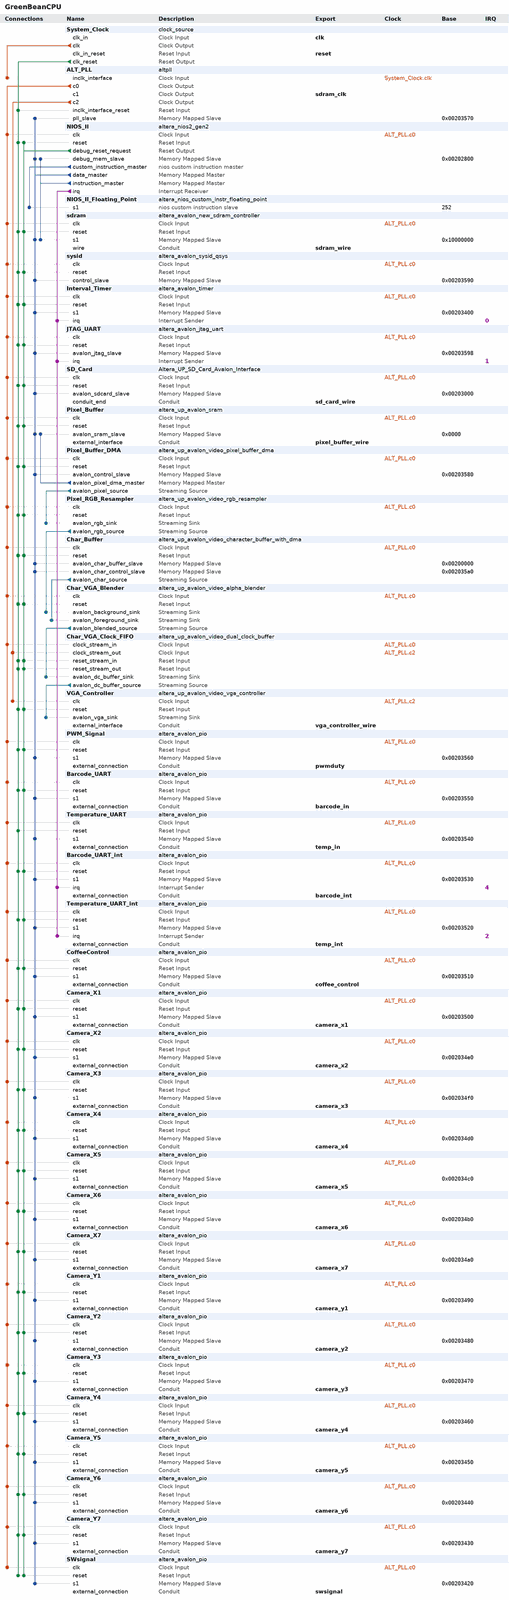
[diagram p0: system contents, whole]
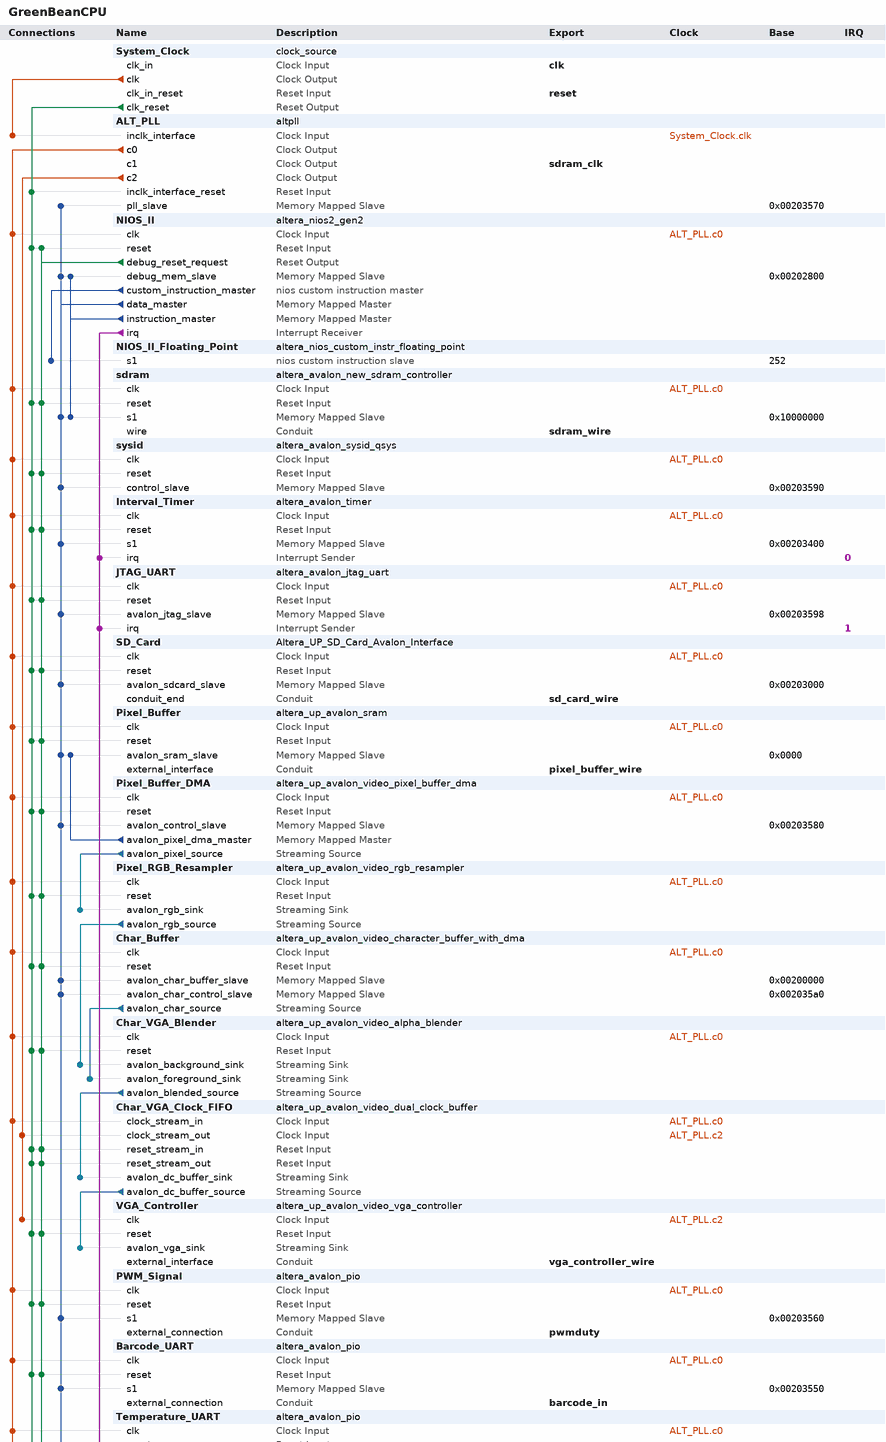
[diagram p1: system contents, upper part]
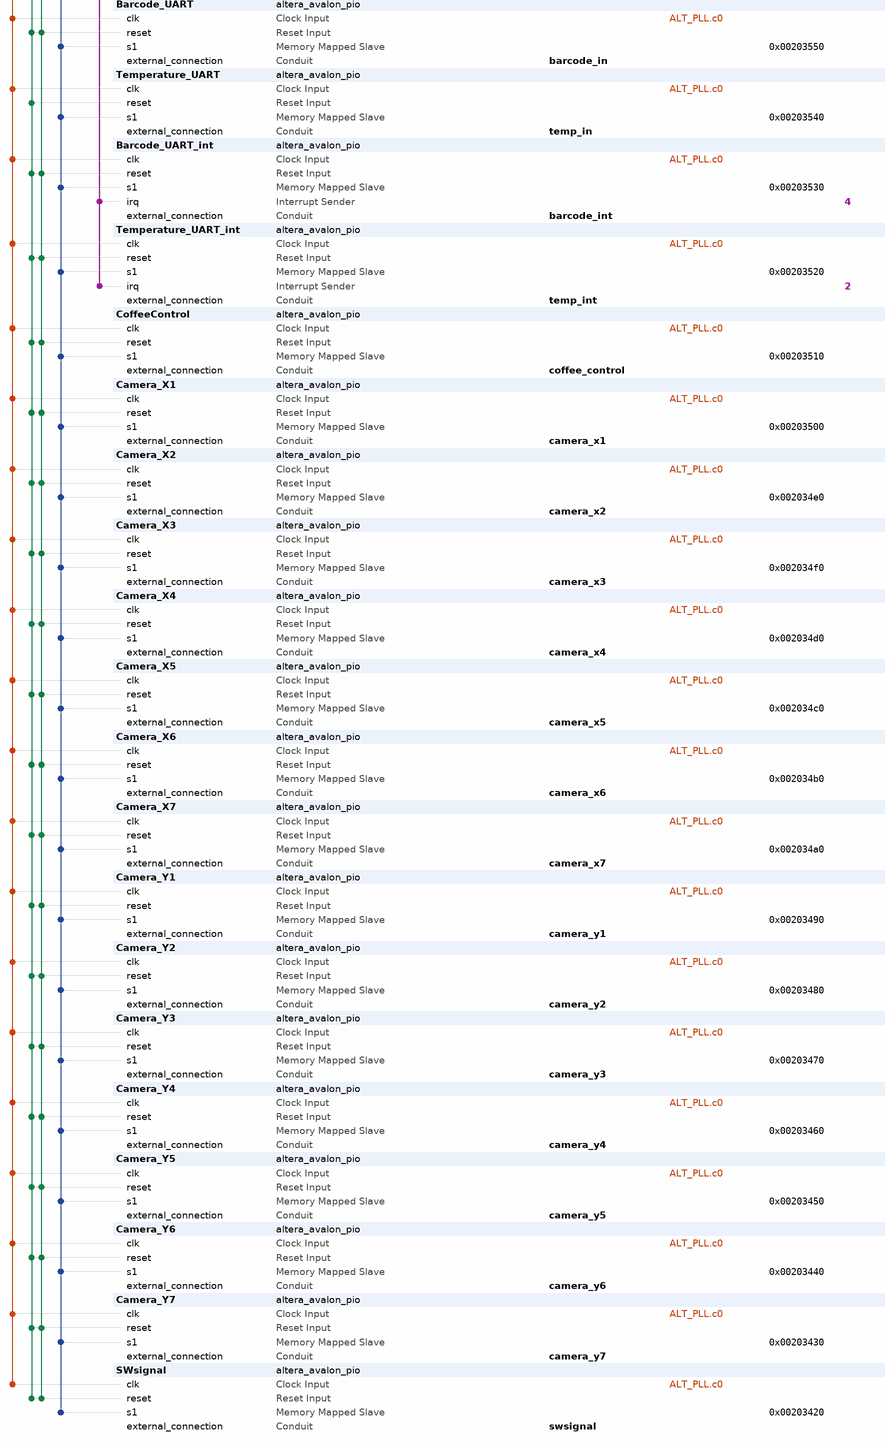
[diagram p2: system contents, lower part]
# Platform Designer (Qsys) system GreenBeanCPU, Cyclone IV E EP4CE115F29C7
# Parameters at their usual value, and those the tool derives, are not listed.
package require -exact qsys 16.1
create_system GreenBeanCPU
set_project_property DEVICE_FAMILY {Cyclone IV E}
set_project_property DEVICE EP4CE115F29C7

add_instance System_Clock clock_source 16.1
set_instance_parameter_value System_Clock clockFrequency 50000000

add_instance ALT_PLL altpll 16.1
set_instance_parameter_value ALT_PLL CLK0_DIVIDE_BY 1
set_instance_parameter_value ALT_PLL CLK0_MULTIPLY_BY 1
set_instance_parameter_value ALT_PLL CLK1_DIVIDE_BY 1
set_instance_parameter_value ALT_PLL CLK1_DUTY_CYCLE 50
set_instance_parameter_value ALT_PLL CLK1_MULTIPLY_BY 1
set_instance_parameter_value ALT_PLL CLK1_PHASE_SHIFT -3000
set_instance_parameter_value ALT_PLL CLK2_DIVIDE_BY 2
set_instance_parameter_value ALT_PLL CLK2_DUTY_CYCLE 50
set_instance_parameter_value ALT_PLL CLK2_MULTIPLY_BY 1
set_instance_parameter_value ALT_PLL CLK2_PHASE_SHIFT 0
set_instance_parameter_value ALT_PLL INCLK0_INPUT_FREQUENCY 20000
set_instance_parameter_value ALT_PLL PORT_ARESET PORT_UNUSED
set_instance_parameter_value ALT_PLL PORT_LOCKED PORT_UNUSED
set_instance_parameter_value ALT_PLL PORT_clk1 PORT_USED
set_instance_parameter_value ALT_PLL PORT_clk2 PORT_USED
set_instance_parameter_value ALT_PLL PORT_clk3 PORT_UNUSED

add_instance NIOS_II altera_nios2_gen2 16.1
set_instance_parameter_value NIOS_II dcache_size 2048
set_instance_parameter_value NIOS_II exceptionSlave sdram.s1
set_instance_parameter_value NIOS_II icache_size 4096
set_instance_parameter_value NIOS_II impl Fast
set_instance_parameter_value NIOS_II resetSlave sdram.s1

add_instance NIOS_II_Floating_Point altera_nios_custom_instr_floating_point 16.1

add_instance sdram altera_avalon_new_sdram_controller 16.1
set_instance_parameter_value sdram TAC 5.5
set_instance_parameter_value sdram TRCD 20.0
set_instance_parameter_value sdram TRP 20.0
set_instance_parameter_value sdram casLatency 3
set_instance_parameter_value sdram columnWidth 10
set_instance_parameter_value sdram dataWidth 32
set_instance_parameter_value sdram generateSimulationModel false
set_instance_parameter_value sdram model single_Micron_MT48LC4M32B2_7_chip
set_instance_parameter_value sdram numberOfBanks 4
set_instance_parameter_value sdram numberOfChipSelects 1
set_instance_parameter_value sdram powerUpDelay 200.0
set_instance_parameter_value sdram refreshPeriod 7.8125
set_instance_parameter_value sdram rowWidth 13

add_instance sysid altera_avalon_sysid_qsys 16.1
set_instance_parameter_value sysid id 0

add_instance Interval_Timer altera_avalon_timer 16.1
set_instance_parameter_value Interval_Timer period 1
set_instance_parameter_value Interval_Timer periodUnits MSEC

add_instance JTAG_UART altera_avalon_jtag_uart 16.1
set_instance_parameter_value JTAG_UART simInteractiveOptions NO_INTERACTIVE_WINDOWS

add_instance SD_Card Altera_UP_SD_Card_Avalon_Interface 16.1

add_instance Pixel_Buffer altera_up_avalon_sram 16.1
set_instance_parameter_value Pixel_Buffer board DE2-115
set_instance_parameter_value Pixel_Buffer pixel_buffer true

add_instance Pixel_Buffer_DMA altera_up_avalon_video_pixel_buffer_dma 16.1
set_instance_parameter_value Pixel_Buffer_DMA addr_mode X-Y
set_instance_parameter_value Pixel_Buffer_DMA back_start_address 0
set_instance_parameter_value Pixel_Buffer_DMA color_space {24-bit RGB}
set_instance_parameter_value Pixel_Buffer_DMA image_height 480
set_instance_parameter_value Pixel_Buffer_DMA image_width 640
set_instance_parameter_value Pixel_Buffer_DMA start_address 0

add_instance Pixel_RGB_Resampler altera_up_avalon_video_rgb_resampler 16.1
set_instance_parameter_value Pixel_RGB_Resampler alpha 1023
set_instance_parameter_value Pixel_RGB_Resampler input_type {24-bit RGB}
set_instance_parameter_value Pixel_RGB_Resampler output_type {30-bit RGB}

add_instance Char_Buffer altera_up_avalon_video_character_buffer_with_dma 16.1
set_instance_parameter_value Char_Buffer enable_transparency true

add_instance Char_VGA_Blender altera_up_avalon_video_alpha_blender 16.1

add_instance Char_VGA_Clock_FIFO altera_up_avalon_video_dual_clock_buffer 16.1
set_instance_parameter_value Char_VGA_Clock_FIFO color_bits 10

add_instance VGA_Controller altera_up_avalon_video_vga_controller 16.1
set_instance_parameter_value VGA_Controller board DE2-115
set_instance_parameter_value VGA_Controller resolution {VGA 640x480}

add_instance PWM_Signal altera_avalon_pio 16.1
set_instance_parameter_value PWM_Signal direction Output
set_instance_parameter_value PWM_Signal width 20

add_instance Barcode_UART altera_avalon_pio 16.1
set_instance_parameter_value Barcode_UART direction Input
set_instance_parameter_value Barcode_UART width 8

add_instance Temperature_UART altera_avalon_pio 16.1
set_instance_parameter_value Temperature_UART direction Input
set_instance_parameter_value Temperature_UART width 8

add_instance Barcode_UART_int altera_avalon_pio 16.1
set_instance_parameter_value Barcode_UART_int captureEdge true
set_instance_parameter_value Barcode_UART_int direction Input
set_instance_parameter_value Barcode_UART_int generateIRQ true
set_instance_parameter_value Barcode_UART_int irqType EDGE
set_instance_parameter_value Barcode_UART_int width 1

add_instance Temperature_UART_int altera_avalon_pio 16.1
set_instance_parameter_value Temperature_UART_int captureEdge true
set_instance_parameter_value Temperature_UART_int direction Input
set_instance_parameter_value Temperature_UART_int generateIRQ true
set_instance_parameter_value Temperature_UART_int irqType EDGE
set_instance_parameter_value Temperature_UART_int width 1

add_instance CoffeeControl altera_avalon_pio 16.1
set_instance_parameter_value CoffeeControl direction Output
set_instance_parameter_value CoffeeControl width 3

add_instance Camera_X1 altera_avalon_pio 16.1
set_instance_parameter_value Camera_X1 direction Input
set_instance_parameter_value Camera_X1 width 17

add_instance Camera_X2 altera_avalon_pio 16.1
set_instance_parameter_value Camera_X2 direction Input
set_instance_parameter_value Camera_X2 width 17

add_instance Camera_X3 altera_avalon_pio 16.1
set_instance_parameter_value Camera_X3 direction Input
set_instance_parameter_value Camera_X3 width 17

add_instance Camera_X4 altera_avalon_pio 16.1
set_instance_parameter_value Camera_X4 direction Input
set_instance_parameter_value Camera_X4 width 17

add_instance Camera_X5 altera_avalon_pio 16.1
set_instance_parameter_value Camera_X5 direction Input
set_instance_parameter_value Camera_X5 width 17

add_instance Camera_X6 altera_avalon_pio 16.1
set_instance_parameter_value Camera_X6 direction Input
set_instance_parameter_value Camera_X6 width 17

add_instance Camera_X7 altera_avalon_pio 16.1
set_instance_parameter_value Camera_X7 direction Input
set_instance_parameter_value Camera_X7 width 17

add_instance Camera_Y1 altera_avalon_pio 16.1
set_instance_parameter_value Camera_Y1 direction Input
set_instance_parameter_value Camera_Y1 width 17

add_instance Camera_Y2 altera_avalon_pio 16.1
set_instance_parameter_value Camera_Y2 direction Input
set_instance_parameter_value Camera_Y2 width 17

add_instance Camera_Y3 altera_avalon_pio 16.1
set_instance_parameter_value Camera_Y3 direction Input
set_instance_parameter_value Camera_Y3 width 17

add_instance Camera_Y4 altera_avalon_pio 16.1
set_instance_parameter_value Camera_Y4 direction Input
set_instance_parameter_value Camera_Y4 width 17

add_instance Camera_Y5 altera_avalon_pio 16.1
set_instance_parameter_value Camera_Y5 direction Input
set_instance_parameter_value Camera_Y5 width 17

add_instance Camera_Y6 altera_avalon_pio 16.1
set_instance_parameter_value Camera_Y6 direction Input
set_instance_parameter_value Camera_Y6 width 17

add_instance Camera_Y7 altera_avalon_pio 16.1
set_instance_parameter_value Camera_Y7 direction Input
set_instance_parameter_value Camera_Y7 width 17

add_instance SWsignal altera_avalon_pio 16.1
set_instance_parameter_value SWsignal direction Output
set_instance_parameter_value SWsignal width 18

# connections
add_connection ALT_PLL.c0 Barcode_UART.clk clock
add_connection ALT_PLL.c0 Barcode_UART_int.clk clock
add_connection ALT_PLL.c0 Camera_X1.clk clock
add_connection ALT_PLL.c0 Camera_X2.clk clock
add_connection ALT_PLL.c0 Camera_X3.clk clock
add_connection ALT_PLL.c0 Camera_X4.clk clock
add_connection ALT_PLL.c0 Camera_X5.clk clock
add_connection ALT_PLL.c0 Camera_X6.clk clock
add_connection ALT_PLL.c0 Camera_X7.clk clock
add_connection ALT_PLL.c0 Camera_Y1.clk clock
add_connection ALT_PLL.c0 Camera_Y2.clk clock
add_connection ALT_PLL.c0 Camera_Y3.clk clock
add_connection ALT_PLL.c0 Camera_Y4.clk clock
add_connection ALT_PLL.c0 Camera_Y5.clk clock
add_connection ALT_PLL.c0 Camera_Y6.clk clock
add_connection ALT_PLL.c0 Camera_Y7.clk clock
add_connection ALT_PLL.c0 Char_Buffer.clk clock
add_connection ALT_PLL.c0 Char_VGA_Blender.clk clock
add_connection ALT_PLL.c0 Char_VGA_Clock_FIFO.clock_stream_in clock
add_connection ALT_PLL.c0 CoffeeControl.clk clock
add_connection ALT_PLL.c0 Interval_Timer.clk clock
add_connection ALT_PLL.c0 JTAG_UART.clk clock
add_connection ALT_PLL.c0 NIOS_II.clk clock
add_connection ALT_PLL.c0 Pixel_Buffer.clk clock
add_connection ALT_PLL.c0 Pixel_Buffer_DMA.clk clock
add_connection ALT_PLL.c0 Pixel_RGB_Resampler.clk clock
add_connection ALT_PLL.c0 PWM_Signal.clk clock
add_connection ALT_PLL.c0 SD_Card.clk clock
add_connection ALT_PLL.c0 sdram.clk clock
add_connection ALT_PLL.c0 SWsignal.clk clock
add_connection ALT_PLL.c0 sysid.clk clock
add_connection ALT_PLL.c0 Temperature_UART.clk clock
add_connection ALT_PLL.c0 Temperature_UART_int.clk clock
add_connection ALT_PLL.c2 Char_VGA_Clock_FIFO.clock_stream_out clock
add_connection ALT_PLL.c2 VGA_Controller.clk clock
add_connection System_Clock.clk ALT_PLL.inclk_interface clock
add_connection NIOS_II.debug_reset_request Barcode_UART.reset reset
add_connection NIOS_II.debug_reset_request Barcode_UART_int.reset reset
add_connection NIOS_II.debug_reset_request Camera_X1.reset reset
add_connection NIOS_II.debug_reset_request Camera_X2.reset reset
add_connection NIOS_II.debug_reset_request Camera_X3.reset reset
add_connection NIOS_II.debug_reset_request Camera_X4.reset reset
add_connection NIOS_II.debug_reset_request Camera_X5.reset reset
add_connection NIOS_II.debug_reset_request Camera_X6.reset reset
add_connection NIOS_II.debug_reset_request Camera_X7.reset reset
add_connection NIOS_II.debug_reset_request Camera_Y1.reset reset
add_connection NIOS_II.debug_reset_request Camera_Y2.reset reset
add_connection NIOS_II.debug_reset_request Camera_Y3.reset reset
add_connection NIOS_II.debug_reset_request Camera_Y4.reset reset
add_connection NIOS_II.debug_reset_request Camera_Y5.reset reset
add_connection NIOS_II.debug_reset_request Camera_Y6.reset reset
add_connection NIOS_II.debug_reset_request Camera_Y7.reset reset
add_connection NIOS_II.debug_reset_request Char_Buffer.reset reset
add_connection NIOS_II.debug_reset_request Char_VGA_Blender.reset reset
add_connection NIOS_II.debug_reset_request Char_VGA_Clock_FIFO.reset_stream_in reset
add_connection NIOS_II.debug_reset_request Char_VGA_Clock_FIFO.reset_stream_out reset
add_connection NIOS_II.debug_reset_request CoffeeControl.reset reset
add_connection NIOS_II.debug_reset_request Interval_Timer.reset reset
add_connection NIOS_II.debug_reset_request JTAG_UART.reset reset
add_connection NIOS_II.debug_reset_request NIOS_II.reset reset
add_connection NIOS_II.debug_reset_request Pixel_Buffer.reset reset
add_connection NIOS_II.debug_reset_request Pixel_Buffer_DMA.reset reset
add_connection NIOS_II.debug_reset_request Pixel_RGB_Resampler.reset reset
add_connection NIOS_II.debug_reset_request PWM_Signal.reset reset
add_connection NIOS_II.debug_reset_request SD_Card.reset reset
add_connection NIOS_II.debug_reset_request sdram.reset reset
add_connection NIOS_II.debug_reset_request SWsignal.reset reset
add_connection NIOS_II.debug_reset_request sysid.reset reset
add_connection NIOS_II.debug_reset_request Temperature_UART_int.reset reset
add_connection NIOS_II.debug_reset_request VGA_Controller.reset reset
add_connection System_Clock.clk_reset ALT_PLL.inclk_interface_reset reset
add_connection System_Clock.clk_reset Barcode_UART.reset reset
add_connection System_Clock.clk_reset Barcode_UART_int.reset reset
add_connection System_Clock.clk_reset Camera_X1.reset reset
add_connection System_Clock.clk_reset Camera_X2.reset reset
add_connection System_Clock.clk_reset Camera_X3.reset reset
add_connection System_Clock.clk_reset Camera_X4.reset reset
add_connection System_Clock.clk_reset Camera_X5.reset reset
add_connection System_Clock.clk_reset Camera_X6.reset reset
add_connection System_Clock.clk_reset Camera_X7.reset reset
add_connection System_Clock.clk_reset Camera_Y1.reset reset
add_connection System_Clock.clk_reset Camera_Y2.reset reset
add_connection System_Clock.clk_reset Camera_Y3.reset reset
add_connection System_Clock.clk_reset Camera_Y4.reset reset
add_connection System_Clock.clk_reset Camera_Y5.reset reset
add_connection System_Clock.clk_reset Camera_Y6.reset reset
add_connection System_Clock.clk_reset Camera_Y7.reset reset
add_connection System_Clock.clk_reset Char_Buffer.reset reset
add_connection System_Clock.clk_reset Char_VGA_Blender.reset reset
add_connection System_Clock.clk_reset Char_VGA_Clock_FIFO.reset_stream_in reset
add_connection System_Clock.clk_reset Char_VGA_Clock_FIFO.reset_stream_out reset
add_connection System_Clock.clk_reset CoffeeControl.reset reset
add_connection System_Clock.clk_reset Interval_Timer.reset reset
add_connection System_Clock.clk_reset JTAG_UART.reset reset
add_connection System_Clock.clk_reset NIOS_II.reset reset
add_connection System_Clock.clk_reset Pixel_Buffer.reset reset
add_connection System_Clock.clk_reset Pixel_Buffer_DMA.reset reset
add_connection System_Clock.clk_reset Pixel_RGB_Resampler.reset reset
add_connection System_Clock.clk_reset PWM_Signal.reset reset
add_connection System_Clock.clk_reset SD_Card.reset reset
add_connection System_Clock.clk_reset sdram.reset reset
add_connection System_Clock.clk_reset SWsignal.reset reset
add_connection System_Clock.clk_reset sysid.reset reset
add_connection System_Clock.clk_reset Temperature_UART.reset reset
add_connection System_Clock.clk_reset Temperature_UART_int.reset reset
add_connection System_Clock.clk_reset VGA_Controller.reset reset
add_connection NIOS_II.data_master ALT_PLL.pll_slave avalon
set_connection_parameter_value NIOS_II.data_master/ALT_PLL.pll_slave baseAddress 0x00203570
add_connection NIOS_II.data_master Barcode_UART.s1 avalon
set_connection_parameter_value NIOS_II.data_master/Barcode_UART.s1 baseAddress 0x00203550
add_connection NIOS_II.data_master Barcode_UART_int.s1 avalon
set_connection_parameter_value NIOS_II.data_master/Barcode_UART_int.s1 baseAddress 0x00203530
add_connection NIOS_II.data_master Camera_X1.s1 avalon
set_connection_parameter_value NIOS_II.data_master/Camera_X1.s1 baseAddress 0x00203500
add_connection NIOS_II.data_master Camera_X2.s1 avalon
set_connection_parameter_value NIOS_II.data_master/Camera_X2.s1 baseAddress 0x002034e0
add_connection NIOS_II.data_master Camera_X3.s1 avalon
set_connection_parameter_value NIOS_II.data_master/Camera_X3.s1 baseAddress 0x002034f0
add_connection NIOS_II.data_master Camera_X4.s1 avalon
set_connection_parameter_value NIOS_II.data_master/Camera_X4.s1 baseAddress 0x002034d0
add_connection NIOS_II.data_master Camera_X5.s1 avalon
set_connection_parameter_value NIOS_II.data_master/Camera_X5.s1 baseAddress 0x002034c0
add_connection NIOS_II.data_master Camera_X6.s1 avalon
set_connection_parameter_value NIOS_II.data_master/Camera_X6.s1 baseAddress 0x002034b0
add_connection NIOS_II.data_master Camera_X7.s1 avalon
set_connection_parameter_value NIOS_II.data_master/Camera_X7.s1 baseAddress 0x002034a0
add_connection NIOS_II.data_master Camera_Y1.s1 avalon
set_connection_parameter_value NIOS_II.data_master/Camera_Y1.s1 baseAddress 0x00203490
add_connection NIOS_II.data_master Camera_Y2.s1 avalon
set_connection_parameter_value NIOS_II.data_master/Camera_Y2.s1 baseAddress 0x00203480
add_connection NIOS_II.data_master Camera_Y3.s1 avalon
set_connection_parameter_value NIOS_II.data_master/Camera_Y3.s1 baseAddress 0x00203470
add_connection NIOS_II.data_master Camera_Y4.s1 avalon
set_connection_parameter_value NIOS_II.data_master/Camera_Y4.s1 baseAddress 0x00203460
add_connection NIOS_II.data_master Camera_Y5.s1 avalon
set_connection_parameter_value NIOS_II.data_master/Camera_Y5.s1 baseAddress 0x00203450
add_connection NIOS_II.data_master Camera_Y6.s1 avalon
set_connection_parameter_value NIOS_II.data_master/Camera_Y6.s1 baseAddress 0x00203440
add_connection NIOS_II.data_master Camera_Y7.s1 avalon
set_connection_parameter_value NIOS_II.data_master/Camera_Y7.s1 baseAddress 0x00203430
add_connection NIOS_II.data_master Char_Buffer.avalon_char_buffer_slave avalon
set_connection_parameter_value NIOS_II.data_master/Char_Buffer.avalon_char_buffer_slave baseAddress 0x00200000
add_connection NIOS_II.data_master Char_Buffer.avalon_char_control_slave avalon
set_connection_parameter_value NIOS_II.data_master/Char_Buffer.avalon_char_control_slave baseAddress 0x002035a0
add_connection NIOS_II.data_master CoffeeControl.s1 avalon
set_connection_parameter_value NIOS_II.data_master/CoffeeControl.s1 baseAddress 0x00203510
add_connection NIOS_II.data_master Interval_Timer.s1 avalon
set_connection_parameter_value NIOS_II.data_master/Interval_Timer.s1 baseAddress 0x00203400
add_connection NIOS_II.data_master JTAG_UART.avalon_jtag_slave avalon
set_connection_parameter_value NIOS_II.data_master/JTAG_UART.avalon_jtag_slave baseAddress 0x00203598
add_connection NIOS_II.data_master NIOS_II.debug_mem_slave avalon
set_connection_parameter_value NIOS_II.data_master/NIOS_II.debug_mem_slave baseAddress 0x00202800
add_connection NIOS_II.data_master Pixel_Buffer.avalon_sram_slave avalon
set_connection_parameter_value NIOS_II.data_master/Pixel_Buffer.avalon_sram_slave baseAddress 0x0000
add_connection NIOS_II.data_master Pixel_Buffer_DMA.avalon_control_slave avalon
set_connection_parameter_value NIOS_II.data_master/Pixel_Buffer_DMA.avalon_control_slave baseAddress 0x00203580
add_connection NIOS_II.data_master PWM_Signal.s1 avalon
set_connection_parameter_value NIOS_II.data_master/PWM_Signal.s1 baseAddress 0x00203560
add_connection NIOS_II.data_master SD_Card.avalon_sdcard_slave avalon
set_connection_parameter_value NIOS_II.data_master/SD_Card.avalon_sdcard_slave baseAddress 0x00203000
add_connection NIOS_II.data_master sdram.s1 avalon
set_connection_parameter_value NIOS_II.data_master/sdram.s1 baseAddress 0x10000000
add_connection NIOS_II.data_master SWsignal.s1 avalon
set_connection_parameter_value NIOS_II.data_master/SWsignal.s1 baseAddress 0x00203420
add_connection NIOS_II.data_master sysid.control_slave avalon
set_connection_parameter_value NIOS_II.data_master/sysid.control_slave baseAddress 0x00203590
add_connection NIOS_II.data_master Temperature_UART.s1 avalon
set_connection_parameter_value NIOS_II.data_master/Temperature_UART.s1 baseAddress 0x00203540
add_connection NIOS_II.data_master Temperature_UART_int.s1 avalon
set_connection_parameter_value NIOS_II.data_master/Temperature_UART_int.s1 baseAddress 0x00203520
add_connection NIOS_II.instruction_master NIOS_II.debug_mem_slave avalon
set_connection_parameter_value NIOS_II.instruction_master/NIOS_II.debug_mem_slave baseAddress 0x00202800
add_connection NIOS_II.instruction_master sdram.s1 avalon
set_connection_parameter_value NIOS_II.instruction_master/sdram.s1 baseAddress 0x10000000
add_connection Pixel_Buffer_DMA.avalon_pixel_dma_master Pixel_Buffer.avalon_sram_slave avalon
set_connection_parameter_value Pixel_Buffer_DMA.avalon_pixel_dma_master/Pixel_Buffer.avalon_sram_slave baseAddress 0x0000
add_connection Char_Buffer.avalon_char_source Char_VGA_Blender.avalon_foreground_sink avalon_streaming
add_connection Char_VGA_Blender.avalon_blended_source Char_VGA_Clock_FIFO.avalon_dc_buffer_sink avalon_streaming
add_connection Char_VGA_Clock_FIFO.avalon_dc_buffer_source VGA_Controller.avalon_vga_sink avalon_streaming
add_connection Pixel_Buffer_DMA.avalon_pixel_source Pixel_RGB_Resampler.avalon_rgb_sink avalon_streaming
add_connection Pixel_RGB_Resampler.avalon_rgb_source Char_VGA_Blender.avalon_background_sink avalon_streaming
add_connection NIOS_II.irq Barcode_UART_int.irq interrupt
set_connection_parameter_value NIOS_II.irq/Barcode_UART_int.irq irqNumber 4
add_connection NIOS_II.irq Interval_Timer.irq interrupt
set_connection_parameter_value NIOS_II.irq/Interval_Timer.irq irqNumber 0
add_connection NIOS_II.irq JTAG_UART.irq interrupt
set_connection_parameter_value NIOS_II.irq/JTAG_UART.irq irqNumber 1
add_connection NIOS_II.irq Temperature_UART_int.irq interrupt
set_connection_parameter_value NIOS_II.irq/Temperature_UART_int.irq irqNumber 2
add_connection NIOS_II.custom_instruction_master NIOS_II_Floating_Point.s1 nios_custom_instruction
set_connection_parameter_value NIOS_II.custom_instruction_master/NIOS_II_Floating_Point.s1 CIName nios_ii_floating_point
set_connection_parameter_value NIOS_II.custom_instruction_master/NIOS_II_Floating_Point.s1 baseAddress 252

# exported interfaces
add_interface barcode_in conduit end
set_interface_property barcode_in EXPORT_OF Barcode_UART.external_connection
add_interface barcode_int conduit end
set_interface_property barcode_int EXPORT_OF Barcode_UART_int.external_connection
add_interface camera_x1 conduit end
set_interface_property camera_x1 EXPORT_OF Camera_X1.external_connection
add_interface camera_x2 conduit end
set_interface_property camera_x2 EXPORT_OF Camera_X2.external_connection
add_interface camera_x3 conduit end
set_interface_property camera_x3 EXPORT_OF Camera_X3.external_connection
add_interface camera_x4 conduit end
set_interface_property camera_x4 EXPORT_OF Camera_X4.external_connection
add_interface camera_x5 conduit end
set_interface_property camera_x5 EXPORT_OF Camera_X5.external_connection
add_interface camera_x6 conduit end
set_interface_property camera_x6 EXPORT_OF Camera_X6.external_connection
add_interface camera_x7 conduit end
set_interface_property camera_x7 EXPORT_OF Camera_X7.external_connection
add_interface camera_y1 conduit end
set_interface_property camera_y1 EXPORT_OF Camera_Y1.external_connection
add_interface camera_y2 conduit end
set_interface_property camera_y2 EXPORT_OF Camera_Y2.external_connection
add_interface camera_y3 conduit end
set_interface_property camera_y3 EXPORT_OF Camera_Y3.external_connection
add_interface camera_y4 conduit end
set_interface_property camera_y4 EXPORT_OF Camera_Y4.external_connection
add_interface camera_y5 conduit end
set_interface_property camera_y5 EXPORT_OF Camera_Y5.external_connection
add_interface camera_y6 conduit end
set_interface_property camera_y6 EXPORT_OF Camera_Y6.external_connection
add_interface camera_y7 conduit end
set_interface_property camera_y7 EXPORT_OF Camera_Y7.external_connection
add_interface clk clock sink
set_interface_property clk EXPORT_OF System_Clock.clk_in
add_interface coffee_control conduit end
set_interface_property coffee_control EXPORT_OF CoffeeControl.external_connection
add_interface pixel_buffer_wire conduit end
set_interface_property pixel_buffer_wire EXPORT_OF Pixel_Buffer.external_interface
add_interface pwmduty conduit end
set_interface_property pwmduty EXPORT_OF PWM_Signal.external_connection
add_interface reset reset sink
set_interface_property reset EXPORT_OF System_Clock.clk_in_reset
add_interface sd_card_wire conduit end
set_interface_property sd_card_wire EXPORT_OF SD_Card.conduit_end
add_interface sdram_clk clock source
set_interface_property sdram_clk EXPORT_OF ALT_PLL.c1
add_interface sdram_wire conduit end
set_interface_property sdram_wire EXPORT_OF sdram.wire
add_interface swsignal conduit end
set_interface_property swsignal EXPORT_OF SWsignal.external_connection
add_interface temp_in conduit end
set_interface_property temp_in EXPORT_OF Temperature_UART.external_connection
add_interface temp_int conduit end
set_interface_property temp_int EXPORT_OF Temperature_UART_int.external_connection
add_interface vga_controller_wire conduit end
set_interface_property vga_controller_wire EXPORT_OF VGA_Controller.external_interface

set_interconnect_requirement {$system} qsys_mm.clockCrossingAdapter HANDSHAKE
set_interconnect_requirement {$system} qsys_mm.enableEccProtection FALSE
set_interconnect_requirement {$system} qsys_mm.insertDefaultSlave FALSE
set_interconnect_requirement {$system} qsys_mm.maxAdditionalLatency 1

save_system GreenBeanCPU.qsys
